# Altium project MD070B.PrjPcb (part 2 of 2)

## Sheet MD070B_INTERFACE.SchDoc
size 431 x 279 mm; Date: Not shown in title block; ApprovedBy: Not shown in title block; CheckedBy: Not shown in title block; Author: Not shown in title block; CompanyName: Not shown in title block; Engineer: Not shown in title block; Organization: Not shown in title block; Address1: Not shown in title block; Address2: Not shown in title block; Address3: Not shown in title block; Address4: Not shown in title block; DocumentNumber: 4; Revision: Use project parameter SCH_Rev; SheetNumber: 1; SheetTotal: 5; PageSetup: Record=PageOptions|CenterHorizontal=True|CenterVertical=True|PrintScale=1.00|XCorrection=1.00|YCorrection=1.00|PrintKind=0|BorderSize=5000000|LeftOffset=0|BottomOffset=0|Orientation=2|PaperLength=1000|PaperWidth=1000|Scale=100|PaperSource=15|PrintQuality=600|MediaType=1|DitherType=10|PaperKind=Letter|PrintScaleMode=1; CurrentTime: Not shown in title block; CurrentDate: Not shown in title block; Time: Not shown in title block; DocumentFullPathAndName: Not shown in title block; DocumentName: Not shown in title block; ModifiedDate: Not shown in title block; ImagePath: Not shown in title block
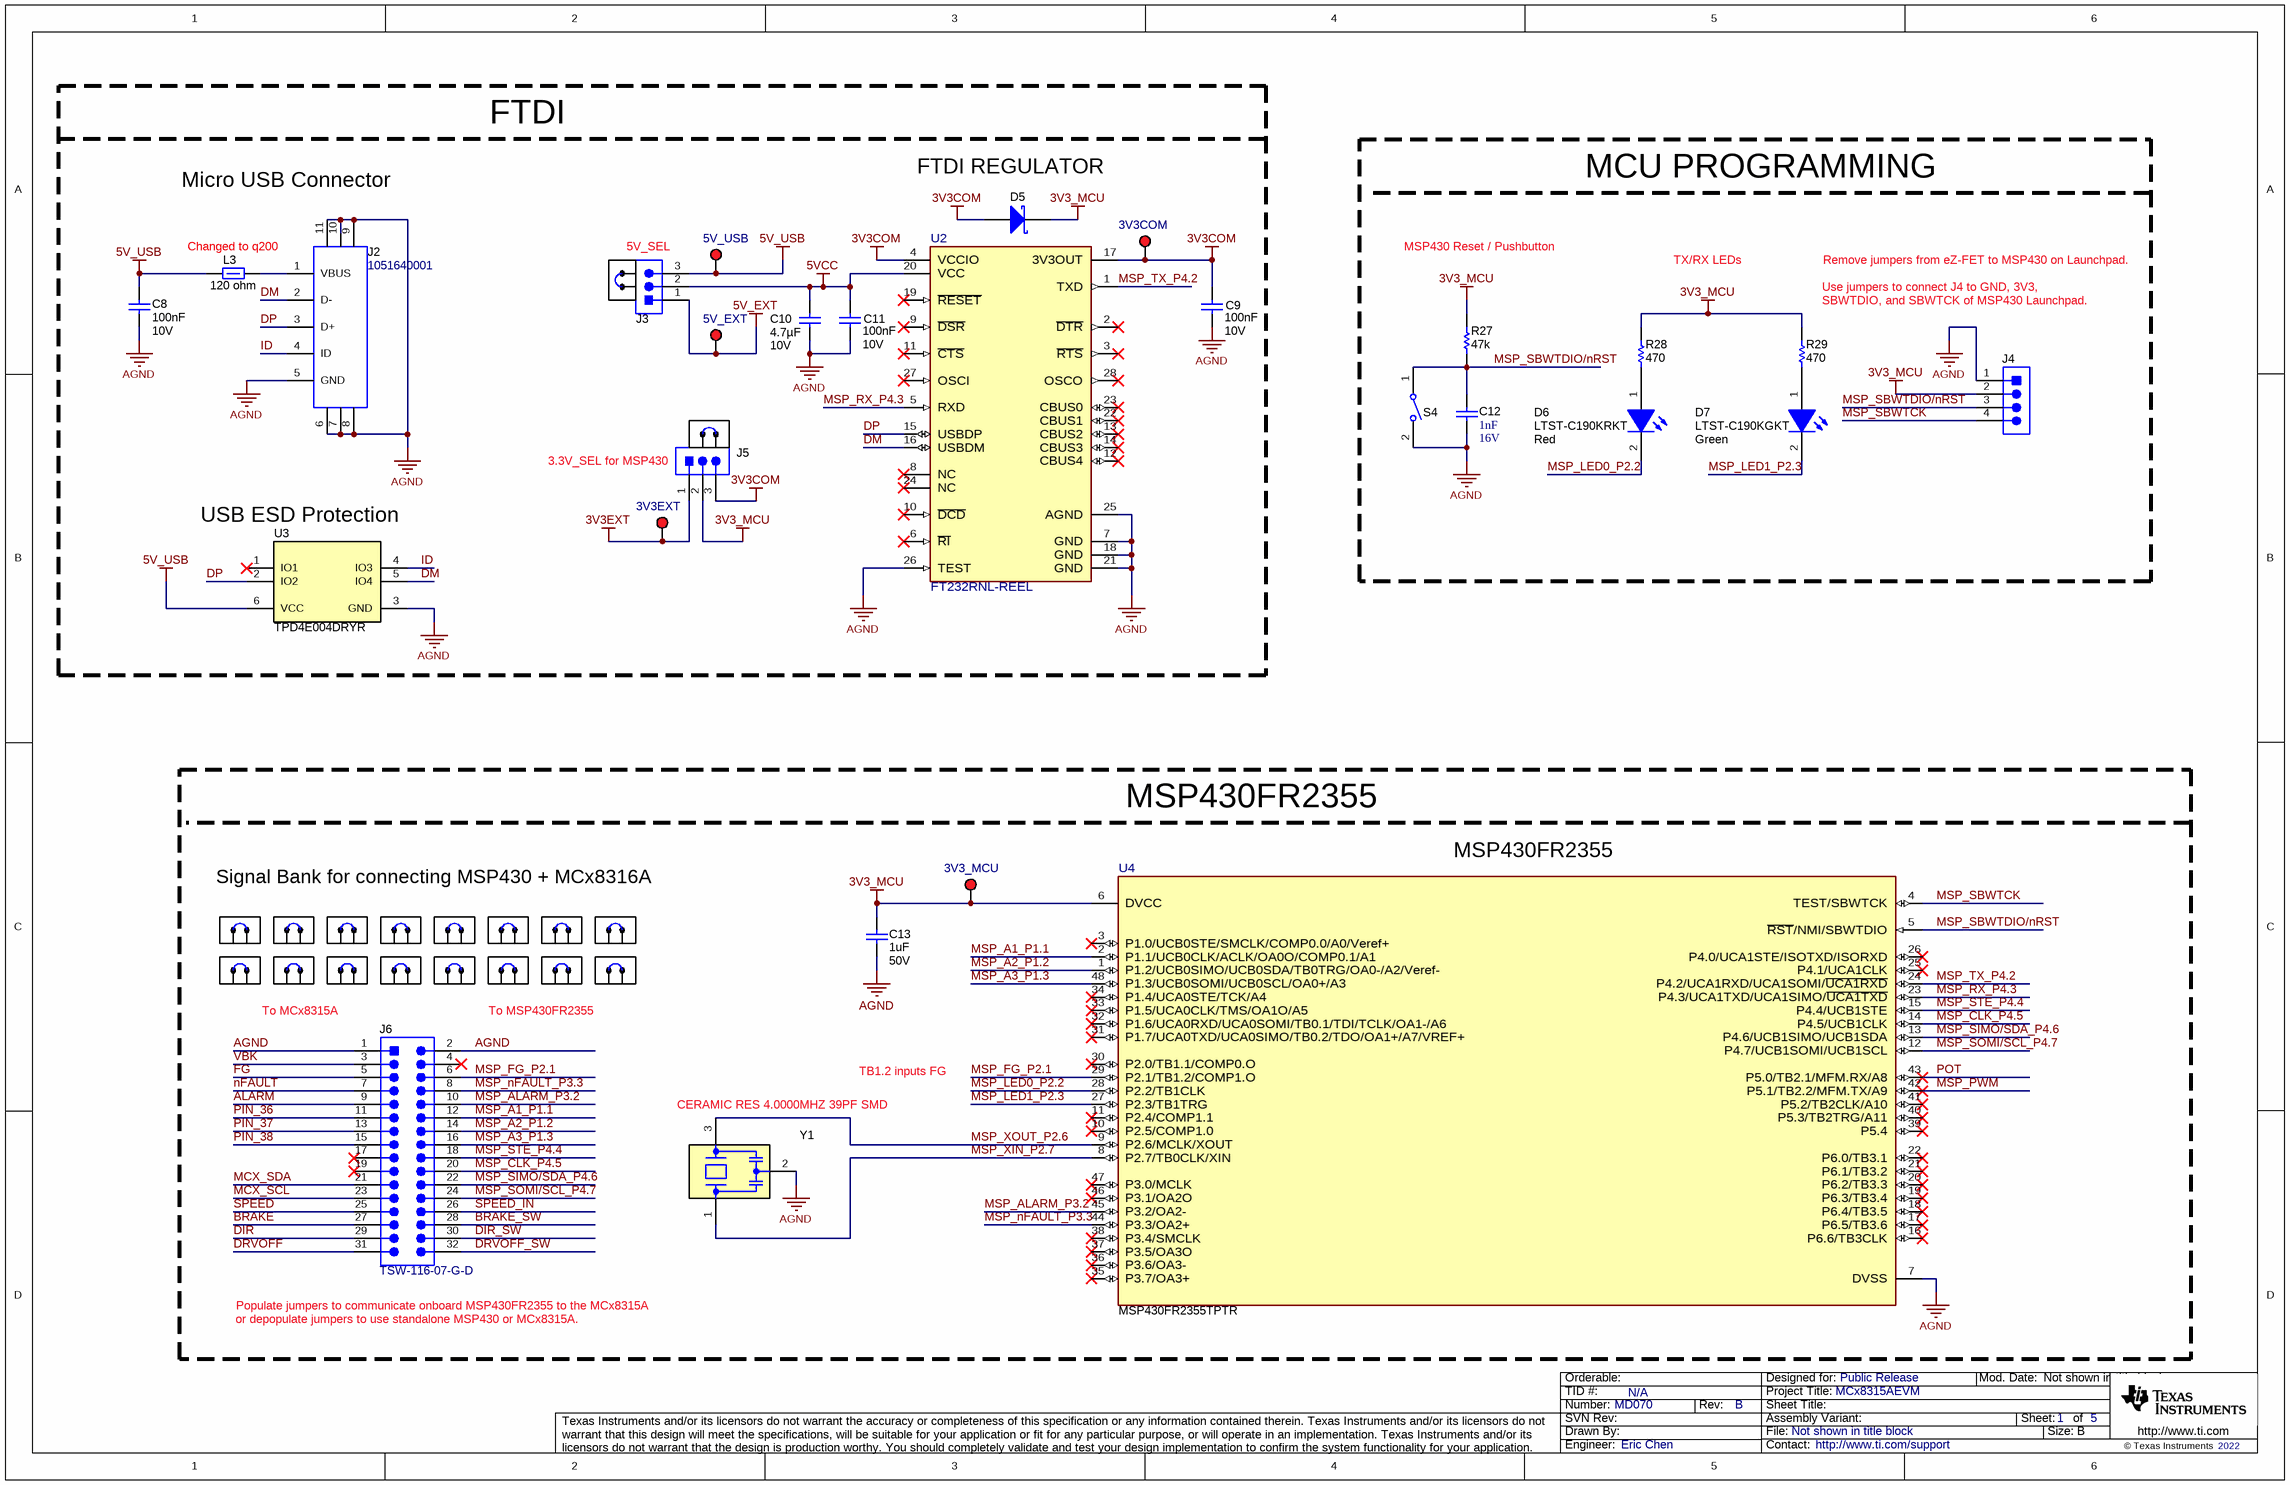
[diagram p3: MD070B_INTERFACE.SchDoc]

### Parts
C8  Cap_F: 100nF  VDC_V: 10V  [0603L]  (hidden comment: 0603ZC104KAT2A)
C9  Cap_F: 100nF  VDC_V: 10V  [0603L]  (hidden comment: 0603ZC104KAT2A)
C10  Cap_F: 4.7µF  VDC_V: 10V  [0603L]  (hidden comment: GRM188Z71A475ME15D)
C11  Cap_F: 100nF  VDC_V: 10V  [0603L]  (hidden comment: 0603ZC104KAT2A)
C12  Cap_F: 1nF  VDC_V: 16V  [0603L]  (hidden comment: 885012206034)
C13  ValueDisplayed: 1uF  VDC_V: 50V  [0805L]  (hidden comment: 885012207103)
D5  BAT165E6327HTSA1  [SOD-323]  (value not drawn)
D6  LTST-C190KRKT  value Red  [LED_LTST-C190_Red]
D7  LTST-C190KGKT  value Green  [LED_LTST-C190_G]
J2  1051640001  [Molex_1051640001]
J3  Header_3x1  [PBC03SAAN]  (value not drawn)
J4  TSW-104-07-G-S  [TSW-104-07-G-S]  (value not drawn)
J5  Header_3x1  [PBC03SAAN]  (value not drawn)
J6  TSW-116-07-G-D  [TSW-116-07-G-D]
L3  DCR_ohm: 120 ohm  [0603L]  (hidden comment: BLM18SG121TZ1D)
R27  ValueDisplayed: 47k  [0603L]  (hidden comment: RC0603JR-0747KL)
R28  ValueDisplayed: 470  [0603L]  (hidden comment: RC0603JR-07470RL)
R29  ValueDisplayed: 470  [0603L]  (hidden comment: RC0603JR-07470RL)
S4  SW_SPST-single  [SW_434121025816]  (value not drawn)
SH-J2  SNT-100-BK-G  [SNT-100-BK-G]  (value not drawn)
SH-J3  SNT-100-BK-G  [SNT-100-BK-G]  (value not drawn)
SH-J4  SNT-100-BK-G  [SNT-100-BK-G]  (value not drawn)
SH-J5  SNT-100-BK-G  [SNT-100-BK-G]  (value not drawn)
SH-J6  SNT-100-BK-G  [SNT-100-BK-G]  (value not drawn)
SH-J7  SNT-100-BK-G  [SNT-100-BK-G]  (value not drawn)
SH-J8  SNT-100-BK-G  [SNT-100-BK-G]  (value not drawn)
SH-J9  SNT-100-BK-G  [SNT-100-BK-G]  (value not drawn)
SH-J10  SNT-100-BK-G  [SNT-100-BK-G]  (value not drawn)
SH-J11  SNT-100-BK-G  [SNT-100-BK-G]  (value not drawn)
SH-J12  SNT-100-BK-G  [SNT-100-BK-G]  (value not drawn)
SH-J13  SNT-100-BK-G  [SNT-100-BK-G]  (value not drawn)
SH-J14  SNT-100-BK-G  [SNT-100-BK-G]  (value not drawn)
SH-J15  SNT-100-BK-G  [SNT-100-BK-G]  (value not drawn)
SH-J16  SNT-100-BK-G  [SNT-100-BK-G]  (value not drawn)
SH-J17  SNT-100-BK-G  [SNT-100-BK-G]  (value not drawn)
SH-J18  SNT-100-BK-G  [SNT-100-BK-G]  (value not drawn)
SH-J19  SNT-100-BK-G  [SNT-100-BK-G]  (value not drawn)
TP18  3V3COM  [Keystone5000]
TP19  5V_USB  [Keystone5000]
TP20  5V_EXT  [Keystone5000]
TP21  3V3EXT  [Keystone5000]
TP22  3V3_MCU  [Keystone5000]
U2  FT232RNL-REEL  [FP-FT232RNL-REEL_SSOP28-MFG]
U3  TPD4E004DRYR  [DRY0006A]
U4  MSP430FR2355TPTR  [PT0048A-MFG]
Y1  CSTCR4M00G55B-R0  [Murata_CSTCR_G]  (value not drawn)

### Blocks framed on the sheet
FTDI: C8-C11 D5 J2 J3 J5 L3 SH-J2 SH-J3 TP18-TP21 U2 U3
MCU PROGRAMMING: C12 D6 D7 J4 R27-R29 S4
MSP430FR2355: C13 J6 SH-J4-SH-J19 TP22 U4 Y1

### Nets
3V3_MCU: C13.1 D5.1(K) J4.2 J5.2 R27.2 R28.2 R29.2 TP22.1 U4.6(DVCC)
3V3COM: C9.1 D5.2(A) J5.3 TP18.1 U2.4(VCCIO) U2.17(3V3OUT)
3V3EXT: J5.1 TP21.1
5V_EXT: J3.1 TP20.1
5V_USB: C8.1 J3.3 L3.1 TP19.1 U3.6(VCC)
5VCC: C10.2 C11.1 J3.2 U2.20(VCC)
AGND: C8.2 C9.2 C10.1 C11.2 C12.2 C13.2 J2.5(GND) J2.6 J2.7 J2.8 J2.9 J2.10 J2.11 J4.1 J6.1 J6.2 S4.2 U2.7(GND) U2.18(GND) U2.21(GND) U2.25(AGND) U2.26(TEST) U3.3(GND) U4.7(DVSS) Y1.2(GND)
VBK: J6.3
ALARM: J6.9
BRAKE: J6.27
BRAKE_SW: J6.28
DIR: J6.29
DIR_SW: J6.30
DM: J2.2(D-) U2.16(USBDM) U3.5(IO4)
DP: J2.3(D+) U2.15(USBDP) U3.2(IO2)
DRVOFF: J6.31
DRVOFF_SW: J6.32
FG: J6.5
ID: J2.4(ID) U3.4(IO3)
MCX_SCL: J6.23
MCX_SDA: J6.21
MSP_A1_P1.1: J6.12 U4.2(P1.1/UCB0CLK/ACLK/OA0O/COMP0.1/A1)
MSP_A2_P1.2: J6.14 U4.1(P1.2/UCB0SIMO/UCB0SDA/TB0TRG/OA0-/A2/Veref-)
MSP_A3_P1.3: J6.16 U4.48(P1.3/UCB0SOMI/UCB0SCL/OA0+/A3)
MSP_ALARM_P3.2: J6.10 U4.45(P3.2/OA2-)
MSP_CLK_P4.5: J6.20 U4.14(P4.5/UCB1CLK)
MSP_FG_P2.1: J6.6 U4.29(P2.1/TB1.2/COMP1.O)
MSP_LED0_P2.2: D6.2(K) U4.28(P2.2/TB1CLK)
MSP_LED1_P2.3: D7.2(K) U4.27(P2.3/TB1TRG)
MSP_nFAULT_P3.3: J6.8 U4.44(P3.3/OA2+)
MSP_PWM: U4.42(P5.1/TB2.2/MFM.TX/A9)
MSP_RX_P4.3: U2.5(RXD) U4.23(P4.3/UCA1TXD/UCA1SIMO/~{UCA1TXD})
MSP_SBWTCK: J4.4 U4.4(TEST/SBWTCK)
MSP_SBWTDIO/nRST: C12.1 J4.3 R27.1 S4.1 U4.5(~{RST}/NMI/SBWTDIO)
MSP_SIMO/SDA_P4.6: J6.22 U4.13(P4.6/UCB1SIMO/UCB1SDA)
MSP_SOMI/SCL_P4.7: J6.24 U4.12(P4.7/UCB1SOMI/UCB1SCL)
MSP_STE_P4.4: J6.18 U4.15(P4.4/UCB1STE)
MSP_TX_P4.2: U2.1(TXD) U4.24(P4.2/UCA1RXD/UCA1SOMI/~{UCA1RXD})
MSP_XIN_P2.7: U4.8(P2.7/TB0CLK/XIN) Y1.1(In)
MSP_XOUT_P2.6: U4.9(P2.6/MCLK/XOUT) Y1.3(Out)
nFAULT: J6.7
PIN_36: J6.11
PIN_37: J6.13
PIN_38: J6.15
POT: U4.43(P5.0/TB2.1/MFM.RX/A8)
SPEED: J6.25
SPEED_IN: J6.26
NetD6_1: D6.1(A) R28.1
NetD7_1: D7.1(A) R29.1
NetJ2_1: J2.1(VBUS) L3.2

Not connected (* = marked no-connect by the designer): J6 4* 17* 19*; U2 2(~{DTR})* 3(~{RTS})* 6(~{RI})* 8(NC)* 9(~{DSR})* 10(~{DCD})* 11(~{CTS})* 12(CBUS4)* 13(CBUS2)* 14(CBUS3)* 19(~{RESET})* 22(CBUS1)* 23(CBUS0)* 24(NC)* 27(OSCI)* 28(OSCO)*; U3 1(IO1)*; U4 3(P1.0/UCB0STE/SMCLK/COMP0.0/A0/Veref+)* 10(P2.5/COMP1.0)* 11(P2.4/COMP1.1)* 16(P6.6/TB3CLK)* 17(P6.5/TB3.6)* 18(P6.4/TB3.5)* 19(P6.3/TB3.4)* 20(P6.2/TB3.3)* 21(P6.1/TB3.2)* 22(P6.0/TB3.1)* 25(P4.1/UCA1CLK)* 26(P4.0/UCA1STE/ISOTXD/ISORXD)* 30(P2.0/TB1.1/COMP0.O)* 31(P1.7/UCA0TXD/UCA0SIMO/TB0.2/TDO/OA1+/A7/VREF+)* 32(P1.6/UCA0RXD/UCA0SOMI/TB0.1/TDI/TCLK/OA1-/A6)* 33(P1.5/UCA0CLK/TMS/OA1O/A5)* 34(P1.4/UCA0STE/TCK/A4)* 35(P3.7/OA3+)* 36(P3.6/OA3-)* 37(P3.5/OA3O)* 38(P3.4/SMCLK)* 39(P5.4)* 40(P5.3/TB2TRG/A11)* 41(P5.2/TB2CLK/A10)* 46(P3.1/OA2O)* 47(P3.0/MCLK)*

### Notes on the sheet
- (near D5) FTDI REGULATOR
- Micro USB Connector
- (near L3) Changed to q200
- 5V_SEL
- MSP430 Reset / Pushbutton
- TX/RX LEDs
- (near R29) Use jumpers to connect J4 to GND, 3V3,
- SBWTDIO, and SBWTCK of MSP430 Launchpad.
- Remove jumpers from eZ-FET to MSP430 on Launchpad.
- (near J5) 3.3V_SEL for MSP430
- (near U3) USB ESD Protection
- Signal Bank for connecting MSP430 + MCx8316A
- (near U4) MSP430FR2355
- To MCx8315A
- To MSP430FR2355
- (near Y1) CERAMIC RES 4.0000MHZ 39PF SMD
- TB1.2 inputs FG
- (near J6) Populate jumpers to communicate onboard MSP430FR2355 to the MCx8315A
- or depopulate jumpers to use standalone MSP430 or MCx8315A.
- Drawn By:
- SVN Rev:
- Number:
- TID #:
- Orderable:
- Rev:
- Sheet Title:
- File:
- Project Title:
- Designed for:
- Assembly Variant:
- Mod. Date:
- Sheet:
- Size:
- of
- B
- http://www.ti.com
- Texas Instruments and/or its licensors do not warrant the accuracy or completeness of this specification or any information contained therein. Texas Instruments and/or its licensors do not warrant that this design will meet the specifications, will be suitable for your application or fit for any particular purpose, or will operate in an implementation. Texas Instruments and/or its licensors do not warrant that the design is production worthy. You should completely validate and test your design implementation to confirm the system functionality for your application.
- Engineer:
- Contact:
- © Texas Instruments

### Library data of the parts
C8 C9 C11 = CMP-0006815-4: CAP, CERM, 0.1 uF, 10 V, +/- 10%, X7R, 0603; Manufacturer: AVX; TaMin_C: -55°C; Polarized: N; SizeAreaWB_mm2: 4.68; Value1: Unknown; U/M: EA; Value: 0.1uF; TaMax_C: 125°C; SizeZ_mm: 1; SizeX_mm: 1.6; SizeY_mm: 0.8; Cap_Case: 0603; SizeArea_mm2: 1.28; AEC Category: Q200; ComponentLink1URL: http://datasheets.avx.com/X7RDielectric.pdf; Supplier Part Number 2: 94W2856; Publisher: Texas Instruments; Supplier 2: Newark; Supplier Part Number 3: 581-0603ZC104K; TempCo: X7R; Supplier 3: Mouser; Published: 2008-06-19; RoHS: Y; MountType: SMT; Supplier 1: Digi-Key; PackageReference: 0603; Tolerance_%: 10%; Value2: 10V; CompType: Capacitor; LatestRevisionDate: 2017-03-09; PartNumber: 0603ZC104KAT2A; AEC Qualified: N; ComponentLink1Description: Datasheet link; AEC Grade: N/A; Supplier Part Number 1: 478-7939-1-ND; Technology: Ceramic; ValueDisplayed: 0.1uF
C10 = CMP-0007498-4: CAP, CERM, 4.7 uF, 10 V, +/- 20%, X7R, 0603; Manufacturer: MuRata; TaMin_C: -55°C; Polarized: N; SizeAreaWB_mm2: 4.68; Value1: Unknown; U/M: EA; Value: 4.7uF; TaMax_C: 125°C; SizeZ_mm: 1; SizeX_mm: 1.6; SizeY_mm: 0.8; Cap_Case: 0603; SizeArea_mm2: 1.28; AEC Category: Q200; Publisher: Texas Instruments; Supplier 2: Newark; Supplier Part Number 3: 81-GRM188Z71A475ME5D; TempCo: X7R; Supplier 3: Mouser; Published: 2008-06-19; RoHS: Y; MountType: SMT; Supplier 1: Digi-Key; PackageReference: 0603; Tolerance_%: 20%; Value2: 10V; CompType: Capacitor; LatestRevisionDate: 2017-03-09; PartNumber: GRM188Z71A475ME15D; AEC Qualified: N; ComponentLink1Description: Datasheet link; AEC Grade: N/A; Technology: Ceramic; ValueDisplayed: 4.7uF; ComponentLink1URL: http://search.murata.co.jp/Ceramy/image/img/A01X/G101/ENG/GRM188Z71A475ME15-01.pdf
C12 = CMP-0006826-4: CAP, CERM, 1000 pF, 16 V, +/- 10%, X7R, 0603; Manufacturer: Wurth Elektronik; TaMin_C: -55°C; Polarized: N; SizeAreaWB_mm2: 4.68; Value1: Unknown; U/M: EA; Value: 1000pF; TaMax_C: 125°C; SizeZ_mm: 1; SizeX_mm: 1.6; SizeY_mm: 0.8; Cap_Case: 0603; SizeArea_mm2: 1.28; AEC Category: Q200; Publisher: Texas Instruments; TempCo: X7R; Published: 2008-06-19; RoHS: Y; MountType: SMT; Supplier 1: Mouser; PackageReference: 0603; Tolerance_%: 10%; Value2: 16V; CompType: Capacitor; LatestRevisionDate: 2017-03-09; PartNumber: 885012206034; AEC Qualified: N; ComponentLink1Description: Datasheet link; AEC Grade: N/A; Supplier Part Number 1: 710-885012206034; Technology: Ceramic; ValueDisplayed: 1000pF; ComponentLink1URL: http://katalog.we-online.de/pbs/datasheet/885012206034.pdf
C13 = CMP-0007696-2: CAP, CERM, 1 uF, 50 V, +/- 10%, X7R, 0805; Manufacturer: Wurth Elektronik; Polarized: N; CompType: Capacitor; Value: 1uF; U/M: EA; Cap_F: 1µF; Value1: Unknown; TaMin_C: -55°C; TaMax_C: 125°C; Cap_Case: 0805; SizeArea_mm2: 2.5; SizeAreaWB_mm2: 6.75; SizeX_mm: 2; SizeY_mm: 1.25; SizeZ_mm: 1.45; AEC Category: Q200; PartNumber: 885012207103; PackageReference: 0805; RoHS: Y; Tolerance_%: 10%; Value2: 50V; MountType: SMT; Technology: Ceramic; TempCo: X7R; Published: 2008-06-19; Publisher: Texas Instruments; LatestRevisionDate: 2017-03-09; ComponentLink1Description: Datasheet link; ComponentLink1URL: http://katalog.we-online.de/pbs/datasheet/885012207103.pdf; Supplier 1: Mouser; Supplier Part Number 1: 710-885012207103; AEC Qualified: N; AEC Grade: N/A
D5 = CMP-0028882-2: Diode, Schottky, 40 V, 0.75 A, AEC-Q101, SOD-323; Manufacturer: Infineon Technologies; Vf_V: 740mV; Value: 40V; Value1: 0.75A; Value2: 0.74V; Io_A: 750mA; TJmax_C: 150°C; AEC Category: Q101; AEC Qualified: Y; Green_Lifecycle: Not Set; Green_REACh: Incomplete; SizeArea_mm2: 3.645; SizeAreaWB_mm2: 8.695; SizeX_mm: 2.7; SizeY_mm: 1.35; SizeZ_mm: 1; CompType: Diode; PartNumber: BAT165E6327HTSA1; PackageReference: SOD-323; Vr_V: 40V; MountType: SMT; Type: Schottky; RoHS: Y; ComponentLink1Description: Datasheet link; ComponentLink1URL: http://www.infineon.com/dgdl/bat165series.pdf?folderId=db3a304313d846880113def5812204a1&fileId=db3a304313d846880113df01f69804d6; Green_EU RoHS-2: Incomplete; Green_EU RoHS: Incomplete
D6 = CMP-0078131-2: LED, Red, SMD; Manufacturer: Lite-On; Type: AlInGaP; Ir_A: 10µA; Angle: 130; Power_TotalModule: 62.5mW; Value2: 2V; Green_Lifecycle: Not Set; Io_A: 20mA; Value1: .0625W; Green_REACh: Incomplete; Vr_V: 5V; Green_EU RoHS: Incomplete; Green_EU RoHS-2: Incomplete; CompType: LED; Color: Red; ComponentLink1URL: http://optoelectronics.liteon.com/upload/download/DS-22-99-0151/LTST-C190KRKT.pdf; RoHS: Y; Vf_V: 2V; PackageReference: Red LED, 1.6x0.8x0.8mm; ComponentLink1Description: Datasheet link; PartNumber: LTST-C190KRKT; MountType: SMT
D7 = CMP-0002840-2: LED, Green, SMD; Manufacturer: Lite-On; Type: AlInGaP; Value2: 2V; Io_A: 30mA; Value1: W; Tjmax_C: 85°C; CompType: LED; Color: green; ComponentLink1URL: http://optoelectronics.liteon.com/en-us/api/DwonloadFileHandler.ashx?txtSpecNo=DS22-2000-074&txtPartNo=LTST-C190KGKT; RoHS: Y; Vf_V: 2V; PackageReference: 1.6x0.8x0.8mm; ComponentLink1Description: Datasheet link; PartNumber: LTST-C190KGKT; MountType: SMT
J2 = CMP-0055311-1: Receptacle, USB 2.0, Micro B, 5 Position, R/A, SMT; Manufacturer: Molex; CNHeader: FALSE; Current_A: 1.8A; Gender: Female; Voltage_V: 30V; Pitch_mm: 0.65; ContactFinish: Gold; CT: TRUE; Cert_UL: Y; ComponentLink1URL: http://www.molex.com/pdm_docs/sd/1051640001_sd.pdf; Supplier Part Number 2: 99Y3224; Publisher: Texas Instruments; Supplier 2: Newark; Supplier Part Number 3: 538-105164-0001; Color: Black; Supplier 3: Mouser; RoHS: Y; MountType: SMT; Supplier 1: Digi-Key; PackageReference: Receptacle, USB 2.0, Micro B, 5 Pos, 0.65mm Pitch, R/A, SMT; PinCount: 5; CompType: USB; LatestRevisionDate: 26/05/2017; PartNumber: 1051640001; Orientation: R/A; ComponentLink1Description: Datasheet URL; Supplier Part Number 1: WM11263CT-ND
J3 J5 = CMP-0002334-1: Header, 100mil, 3x1, Gold, TH; Manufacturer: Sullins Connector Solutions; CNHeader: TRUE; CT: FALSE; Green_Lifecycle: Not Set; Green_REACh: Incomplete; PartNumber: PBC03SAAN; PackageReference: PBC03SAAN; ClassName: Header; CompType: Header; RoHS: Y; MountType: TH; ComponentLink1Description: Datasheet URL; ComponentLink1URL: http://www.sullinscorp.com/catalogs/77_Page78-79_HEADER_.100_2.54mm_MALE_BREAKAWAY.pdf; Publisher: Texas Instruments; LatestRevisionDate: 26/05/2017; Supplier 1: Digi-Key; Supplier Part Number 1: S1011E-03-ND; Green_EU RoHS-2: Incomplete; Green_EU RoHS: Incomplete
J4 = CMP-0075409-2: Header, 100mil, 4x1, Gold, TH; Manufacturer: Samtec; Pitch_mm: 2.54; Cert_VDE: N; Gender: Male; Cert_CSA: Y; Voltage_V: 550V; Green_REACh: Passed; Current_A: 6.3A; Green_Lifecycle: Active; Row_Count: 1; ComponentLink1Description: Datasheet URL; RoHS: Y; Supplier 1: Digi-Key; Cert_UL: Y; Orientation: Vertical; Green_EU RoHS: Passed; PackageReference: 4x1 Header; Color: Black; PartNumber: TSW-104-07-G-S; PinCount: 4; ContactFinish: Gold; Cert_CULUS: N; Shrouded: N; ClassName: Header; ComponentLink1URL: http://samtec.com/ftppub/pdf/TSW_TH.PDF; CompType: Header; MountType: TH; Supplier Part Number 1: SAM1029-04-ND; Green_EU RoHS-2: Passed
J6 = CMP-0075429-1: Header, 100mil, 16x2, Gold, TH; Manufacturer: Samtec; Pitch_mm: 2.54; Cert_VDE: N; Gender: Male; Cert_CSA: Y; Voltage_V: 550V; Green_REACh: Passed; Current_A: 6.3A; CT: False; Green_Lifecycle: Active; Row_Count: 2; CNHeader: True; ComponentLink1Description: Datasheet URL; RoHS: Y; Supplier 1: Digi-Key; Cert_UL: Y; Orientation: Vertical; Green_EU RoHS: Passed; PackageReference: 16x2 Header; Color: Black; PartNumber: TSW-116-07-G-D; PinCount: 32; Publisher: Texas Instruments; ContactFinish: Gold; Cert_CULUS: N; Shrouded: N; ClassName: Header; RowSpacing_mm: 2.54; ComponentLink1URL: http://samtec.com/ftppub/pdf/TSW_TH.PDF; LatestRevisionDate: 2017-07-12; CompType: Header; MountType: TH; Supplier Part Number 1: SAM1028-16-ND; Green_EU RoHS-2: Passed
L3 = CMP-0084877-1: Inductor, Ferrite Bead, Ferrite, 3 A, 120 ohm, AEC-Q200 Grade 1, SMD; Manufacturer: MuRata; SizeX_mm: 1.6; AEC Grade: 1; Value2: 3A; SizeY_mm: 0.8; SizeAreaWB_mm2: 4.68; SizeArea_mm2: 1.28; AEC Qualified: Y; AEC Category: Q200; CompType: Inductor; Technology: Ferrite Bead; Value1: 120 ohm; RoHS: Y; ComponentLink1URL: https://www.murata.com/en-us/products/productdata/8796750610462/QNFA9122.pdf; SizeZ_mm: 1; Material: Ferrite; PackageReference: 0603; PartNumber: BLM18SG121TZ1D; MountType: SMT; Imax_A: 3A; ComponentLink1Description: Datasheet link
R27 = CMP-0025925-5: RES, 47 k, 5%, 0.1 W, 0603; Manufacturer: Yageo; Power_W: 100mW; TempCo: 100 ppm/C; Value_Code: 47k0; Value: 47k; EIA_Code: E24; SizeX_mm: 1.6; SizeY_mm: 0.8; SizeZ_mm: 1; Value2: 0.1W; SizeArea_mm2: 1.28; AEC Qualified: N; VDC_V: 75V; AEC Category: Q200; SizeAreaWB_mm2: 4.68; Supplier Part Number 2: 603-RC0603JR-0747KL; Supplier 2: Mouser; Supplier Part Number 3: 9233580; Supplier 3: Farnell; RoHS: Y; Value1: 5%; MountType: SMT; Supplier 1: Digi-Key; PackageReference: 0603; Tolerance_%: 5%; Res_ohm: 47k; CompType: Resistor; PartNumber: RC0603JR-0747KL; ComponentLink1Description: Datasheet link; Supplier Part Number 1: 311-47KGRCT-ND; Technology: Thick Film; ComponentLink1URL: http://www.yageo.com/pdf/Pu-RC0603_51_PbFree_L_2.pdf; AEC Grade: N/A
R28 R29 = CMP-0025924-5: RES, 470, 5%, 0.1 W, 0603; Manufacturer: Yageo; Power_W: 100mW; TempCo: 100 ppm/C; Value_Code: 470R; Value: 470; EIA_Code: E24; SizeX_mm: 1.6; SizeY_mm: 0.8; SizeZ_mm: 1; Value2: 0.1W; SizeArea_mm2: 1.28; AEC Qualified: N; VDC_V: 75V; AEC Category: Q200; SizeAreaWB_mm2: 4.68; Supplier Part Number 2: 603-RC0603JR-07470RL; Supplier 2: Mouser; Supplier Part Number 3: 9233334; Supplier 3: Farnell; RoHS: Y; Value1: 5%; MountType: SMT; Supplier 1: Digi-Key; PackageReference: 0603; Tolerance_%: 5%; Res_ohm: 470; CompType: Resistor; PartNumber: RC0603JR-07470RL; ComponentLink1Description: Datasheet link; Supplier Part Number 1: 311-470GRCT-ND; Technology: Thick Film; ComponentLink1URL: http://www.yageo.com/pdf/Pu-RC0603_51_PbFree_L_2.pdf; AEC Grade: N/A
S4 = CMP-0002196-2: Switch, Tactile, SPST, 12 V, SMD; PartNumber: 434121025816; Manufacturer: Wurth Elektronik; VDC_V: 12V; SwitchFunction: Off-On; PositionCount: 1; CurrentRating_mA: 50A; MountType: SMT; ComponentLink1Description: Datasheet URL; ComponentLink1URL: http://katalog.we-online.de/em/datasheet/434121025816.pdf; RoHS: Y; Circuit: SPST; Orientation: Top Actuated; CompType: Switch; PackageReference: SMD, 6x3.9mm; Publisher: Texas Instruments; LatestRevisionDate: 2017-03-09; Supplier 1: Newark; Supplier Part Number 1: 31T8978; Supplier 2: Farnell; Supplier Part Number 2: 1867991
SH-J2-SH-J19 = CMP-0003623-3: as SH-J1 on sheet MD070B_CONTROL; ComponentLink1URL: http://www.samtec.com/ftppub/pdf/SNT.PDF; Supplier 1: Digi-Key; CompType: Shunt; PackageReference: Shunt; ClassName: Shunt; RoHS: Y; Supplier Part Number 1: SAM8858-ND; MountType: N/A; PartNumber: SNT-100-BK-G; ComponentLink1Description: Datasheet Link
TP18-TP22 = CMP-0055137-1: Test Point, Miniature, Red, TH; PartNumber: 5000; Manufacturer: Keystone; ContactFinish: Silver; CNHeader: FALSE; CT: TRUE; Green_Lifecycle: Active; Green_REACh: Passed; PackageReference: Red Miniature Testpoint; CompType: Test Point; RoHS: Y; MountType: TH; ComponentLink1Description: Datasheet URL; ComponentLink1URL: http://www.keyelco.com/userAssets/file/M60-2p60.pdf; Publisher: Texas Instruments; LatestRevisionDate: 26/05/2017; Supplier 1: Digi-Key; Supplier Part Number 1: 36-5000-ND; Supplier 2: Mouser; Supplier Part Number 2: 534-5000; Color: Red; Green_EU RoHS-2: Incomplete; Green_EU RoHS: Passed
U2 = CMP-0121693-1: UART Interface IC USB Full Speed to Serial UART IC, Includes Oscillator and EEPROM, SSOP-28; Manufacturer: FTDI; SizeZ_mm: 2mm; AEC Qualified: No; Data Rate: 3Mbits/s; Interface: UART,USB; Max Supply Voltage: 5.25V; Min Supply Voltage: 1.8V; Nominal Supply Current: 7mA; Number Of Ports: 1; Standoff Height: 0.05mm; TaMax_C: +85°C; TaMin_C: -40°C; Usb Standard: USB 2.0; PackageReference: SSOP28; PartNumber: FT232RNL-REEL; RoHS: TRUE; Supplier 1: Digikey; Supplier 2: Mouser; Supplier Part Number 1: 768-FT232RNL-REELCT-ND; Supplier Part Number 2: 895-FT232RNL-REEL; Part Number: FT232RNL-REEL; datasheet: https://ftdichip.com/wp-content/uploads/2023/03/DS_FT232RN.pdf; Datasheet Path: datasheets/IC-FT232RNL-REEL.pdf; Digikey Description: USB FULL SPEED TO SERIAL UART IC; Digikey Part Number: 768-FT232RNL-REELCT-ND; helpURL: https://upverter.com/upn/revision/7db2f58cc6935634/; Lead Free: Yes; Mouser Description: Integrated Circuit Interface USB-UART; RS-232; 12Mbs; 3, 3v-5.25V; -40+85 deg.C; SMD; SSOP28; Mouser Part Number: 895-FT232RNL-REEL; Operating Temperature Range: -40°C to +85°C; ComponentLink1Description: Datasheet; ComponentLink1URL: https://ftdichip.com/wp-content/uploads/2023/03/DS_FT232RN.pdf
U3 = CMP-0043115-3: 4-Channel ESD Protection Array for High-Speed Data Interfaces, DRY0006A (USON-6); Manufacturer: Texas Instruments; IO Leakage Current(nA): 1; USB High Speed: TRUE; IO Capacitance(Typ)(pF): 1.6; Eco-Plan: Green (RoHS & no Sb/Br); IEC 61000-4-2 Contact(+/- kV): 8; Breakdown Voltage(Min)(V): 6; IEC 61000-4-2 Air-Gap(+/- kV): 12; AEC Category: Q200; AEC Qualified: N; CompType: IC; SizeAreaWB_mm2: 4.9; SizeArea_mm2: 1.45; SizeX_mm: 1.0; SizeZ_mm: 0.6; Rating: Catalog; ComponentLink3URL: http://www.ti.com/product/tpd4e004/datasheet; ComponentLink1Description: Datasheet Link; ComponentLink2URL: http://www.ti.com/product/tpd4e004; ComponentLink1URL: http://www.ti.com/lit/ds/symlink/tpd4e004.pdf; PackageDescription: USON-6; 1394 / Firewire: TRUE; PackageReference: DRY0006A; ComponentLink3Description: Online Datasheet; ComponentLink2Description: Product Folder; Serial ATA / eSATA: TRUE; PartNumber: TPD4E004DRYR; MountType: SMT; RoHS: Y; SizeY_mm: 1.45; Operating Temperature Range: -40 to 85 C
U4 = CMP-0089204-1: CPU16 MSP430™ FRAM Microcontroller IC 16-Bit 24MHz 32KB (32K x 8) FRAM 48-LQFP (7x7); Manufacturer: Texas Instruments; Memory Type: OTHER; Data Bus Width: 16bits; Number Of Spi Channels: 4; Number Of I/Os: 44; Number Of Uart Channels: 2; AEC Qualified: No; Standoff Height: 0.05mm; Ram Size: 4KBytes; TaMin_C: -40°C; Core Architecture: RISC; Number Of Adc Channels: 12; SizeZ_mm: 1.6mm; Number Of A/D Converters: 1; Memory Size: 32KBytes; TaMax_C: +105°C; TJmax_C: +115°C; Interface: I2C,SPI,UART,USART,SCI,IrDA; Min Supply Voltage: 1.8V; Max Supply Voltage: 3.6V; datasheet: http://www.ti.com/lit/ds/symlink/msp430fr2355.pdf; Part Number: MSP430FR2355TPTR; Device Class L1: Integrated Circuits (ICs); Digikey Part Number: 296-50261-1-ND; Datasheet Path: datasheets/IC-MSP430FR2355TPTR.pdf; Frequency_Fixed: 24MHz; PartNumber: MSP430FR2355TPTR; Operating Temperature Range: -40°C to +105°C; Device Class L2: Embedded Processors and Controllers; RoHS: TRUE; Mouser Part Number: 595-MSP430FR2355TPTR; Number Of Timers/Counters: 4; Number Of I2C Channels: 2; Number Of Cores: 1; helpURL: https://upverter.com/upn/revision/f866b8320dbaa695/; Device Class L3: Microcontrollers; Lead Free: Yes; Digikey Description: IC MCU 16BIT 32KB FRAM 48LQFP; ComponentLink1Description: Datasheet; PackageReference: LQFP48; ComponentLink1URL: http://www.ti.com/lit/ds/symlink/msp430fr2355.pdf
Y1 = CMP-0084387-1: Resonator, 4 MHz, 39 pF, AEC-Q200 Grade 1, SMD; Manufacturer: MuRata; Load Capacitance: 39 pF; AEC Qualified: Y; TaMax_C: 125°C; AEC Category: Q200; SizeArea_mm2: 9; SizeZ_mm: 1.2; Frequency_Fixed: 4MHz; SizeAreaWB_mm2: 16.5; SizeY_mm: 2; SizeX_mm: 4.5; TaMin_C: -40°C; AEC Grade: 1; PackageReference: 4.5x1.2x2 mm; ComponentLink1Description: Datasheet Link; MountType: SMT; CompType: Resonator; PartNumber: CSTCR4M00G55B-R0; ComponentLink1URL: https://www.murata.com/~/media/webrenewal/support/library/catalog/products/timingdevice/ceralock/p16e.ashx; RoHS: Y

## Sheet MD070B_POWER_AND_CONNECTORS.SchDoc
size 431 x 279 mm; Date: Not shown in title block; ApprovedBy: Not shown in title block; CheckedBy: Not shown in title block; Author: Not shown in title block; CompanyName: Not shown in title block; Engineer: Not shown in title block; Organization: Not shown in title block; Address1: Not shown in title block; Address2: Not shown in title block; Address3: Not shown in title block; Address4: Not shown in title block; DocumentNumber: 5; Revision: Use project parameter SCH_Rev; SheetNumber: 4; SheetTotal: 5; PageSetup: Record=PageOptions|CenterHorizontal=True|CenterVertical=True|PrintScale=1.00|XCorrection=1.00|YCorrection=1.00|PrintKind=0|BorderSize=5000000|LeftOffset=0|BottomOffset=0|Orientation=2|PaperLength=1000|PaperWidth=1000|Scale=100|PaperSource=15|PrintQuality=600|MediaType=1|DitherType=10|PaperKind=Letter|PrintScaleMode=1; CurrentTime: Not shown in title block; CurrentDate: Not shown in title block; Time: Not shown in title block; DocumentFullPathAndName: Not shown in title block; DocumentName: Not shown in title block; ModifiedDate: Not shown in title block; ImagePath: Not shown in title block
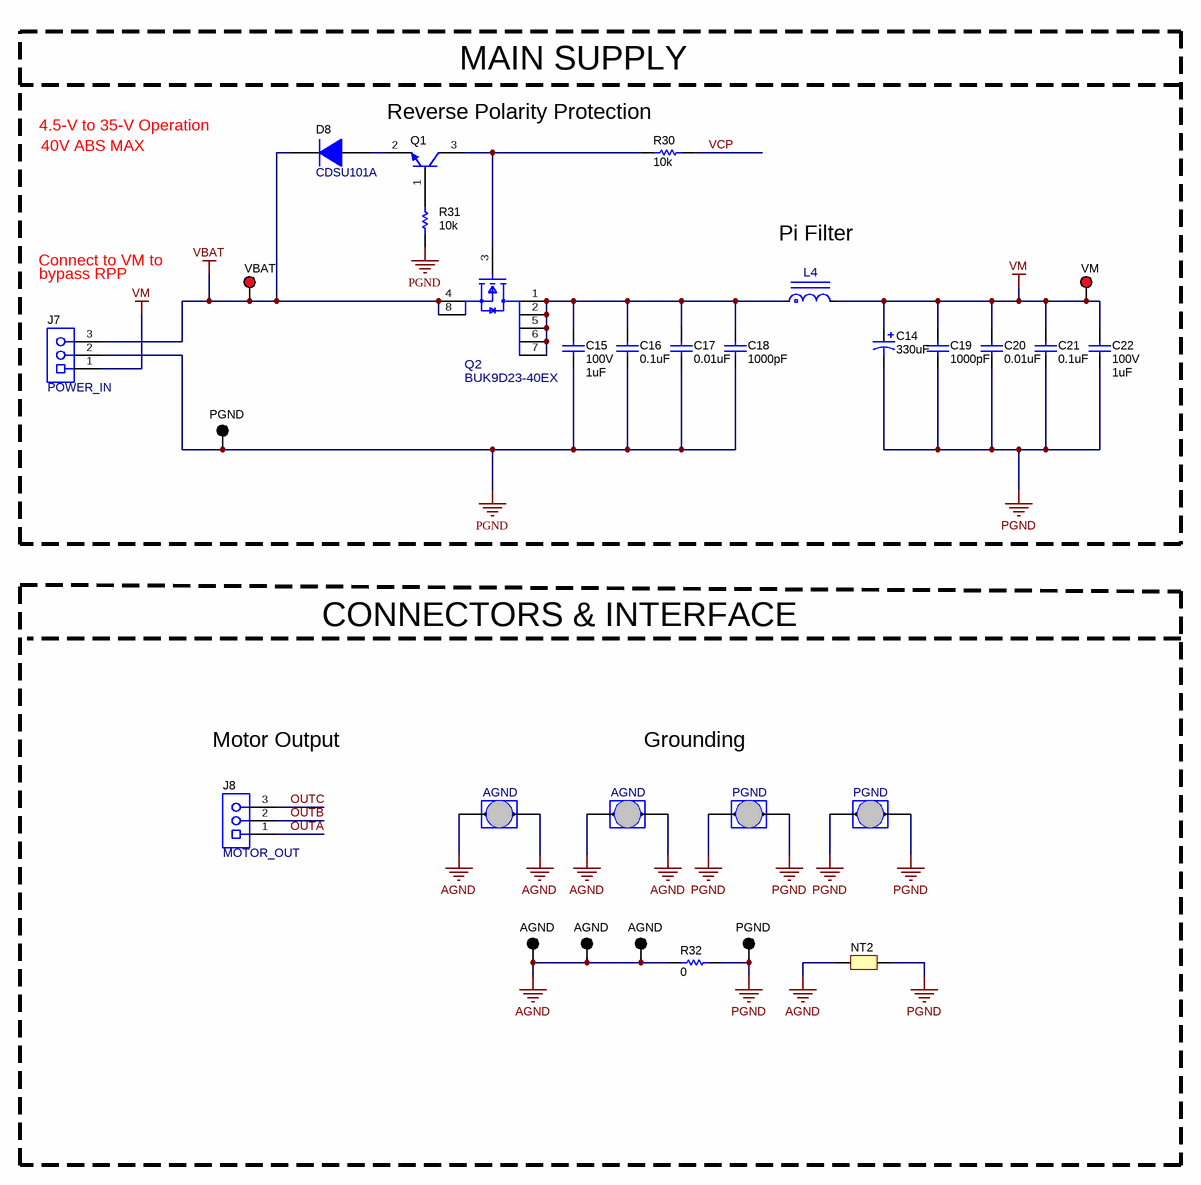
[diagram p4: MD070B_POWER_AND_CONNECTORS.SchDoc]

### Parts
C14  ValueDisplayed: 330uF  [Chemi-Con_1250x2000]  (hidden comment: ELXZ630ELL331MK20S)
C15  VDC_V: 100V  ValueDisplayed: 1uF  [1206_180]  (hidden comment: CL31B105KCHNNNE)
C16  ValueDisplayed: 0.1uF  [0603L]  (hidden comment: CGA3E3X7S2A104K080AB)
C17  ValueDisplayed: 0.01uF  [0603L]  (hidden comment: CGA3E2X7R2A103K080AA)
C18  ValueDisplayed: 1000pF  [0603L]  (hidden comment: CGA3E2X7R2A102K080AA)
C19  ValueDisplayed: 1000pF  [0603L]  (hidden comment: CGA3E2X7R2A102K080AA)
C20  ValueDisplayed: 0.01uF  [0603L]  (hidden comment: CGA3E2X7R2A103K080AA)
C21  ValueDisplayed: 0.1uF  [0603L]  (hidden comment: CGA3E3X7S2A104K080AB)
C22  VDC_V: 100V  ValueDisplayed: 1uF  [1206_180]  (hidden comment: CL31B105KCHNNNE)
D8  CDSU101A  [SOD-523F]
J7  POWER_IN  [On-Shore_ED120_3DS]
J8  MOTOR_OUT  [On-Shore_ED120_3DS]
L4  HCM1A1104V2-1R0-R  [FP-HCM1A1104V2-1R0-R_SMD2-MFG]  (value not drawn)
NT2  Net-Tie  [Net-Tie_50milWide_30milLong]  (value not drawn)  (net tie, no BOM)
Q1  FMMT620TA  [SOT-23L]  (value not drawn)
Q2  BUK9D23-40EX  [FP-BUK9D23-40EX_SOT1220-MFG]
R30  value 10k  [0603L]  (hidden comment: CRCW060310K0JNEA)
R31  value 10k  [0603L]  (hidden comment: CRCW060310K0JNEA)
R32  ValueDisplayed: 0  [1206L]  (hidden comment: RCA12060000ZSEA)
TP23  VBAT  [Keystone5005]
TP24  VM  [Keystone5005]
TP25  PGND  [Keystone5001]
TP26  AGND  [Harwin_D3082-05]
TP27  AGND  [Harwin_D3082-05]
TP28  PGND  [Harwin_D3082-05]
TP29  PGND  [Harwin_D3082-05]
TP30  AGND  [Keystone5001]
TP31  AGND  [Keystone5001]
TP32  AGND  [Keystone5001]
TP33  PGND  [Keystone5001]

### Blocks framed on the sheet
MAIN SUPPLY: C14-C22 D8 J7 L4 Q1 Q2 R30 R31 TP23-TP25
CONNECTORS & INTERFACE: J8 NT2 R32 TP26-TP33

### Nets
AGND: NT2.1 R32.1 TP26.1 TP26.2 TP27.1 TP27.2 TP30.1 TP31.1 TP32.1
PGND: C14.2(-) C15.2 C16.2 C17.2 C18.2 C19.2 C20.2 C21.2 C22.2 J7.2 NT2.2 R31.2 R32.2 TP25.1 TP28.1 TP28.2 TP29.1 TP29.2 TP33.1
VBAT: D8.1(K) J7.3 Q2.4(S) Q2.8(S) TP23.1
VM: C14.1(+) C19.1 C20.1 C21.1 C22.1 J7.1 L4.2 TP24.1
OUTA: J8.1
OUTB: J8.2
OUTC: J8.3
VCP: R30.1
NetC15_1: C15.1 C16.1 C17.1 C18.1 L4.1 Q2.1(D) Q2.2(D) Q2.5(D) Q2.6(D) Q2.7(D)
NetD8_2: D8.2(A) Q1.2(E)
NetQ1_1: Q1.1(B) R31.1
NetQ1_3: Q1.3(C) Q2.3(G) R30.2

### Notes on the sheet
- 40V ABS MAX
- 4.5-V to 35-V Operation
- Reverse Polarity Protection
- bypass RPP
- Connect to VM to
- Pi Filter
- Motor Output
- Grounding
- Drawn By:
- SVN Rev:
- Number:
- TID #:
- Orderable:
- Rev:
- Sheet Title:
- File:
- Project Title:
- Designed for:
- Assembly Variant:
- Mod. Date:
- Sheet:
- Size:
- of
- B
- http://www.ti.com
- Texas Instruments and/or its licensors do not warrant the accuracy or completeness of this specification or any information contained therein. Texas Instruments and/or its licensors do not warrant that this design will meet the specifications, will be suitable for your application or fit for any particular purpose, or will operate in an implementation. Texas Instruments and/or its licensors do not warrant that the design is production worthy. You should completely validate and test your design implementation to confirm the system functionality for your application.
- Engineer:
- Contact:
- © Texas Instruments

### Library data of the parts
C14 = CMP-0009912-2: CAP, AL, 330 uF, 63 V, +/- 20%, AEC-Q200 Grade 2, TH; Manufacturer: Chemi-Con; Polarized: Y; CompType: Capacitor; Value: 330uF; U/M: EA; Cap_F: 330µF; Value1: Unknown; VDC_V: 63V; IRMS_A: 1.29A; TaMin_C: -55°C; TaMax_C: 105°C; Cap_Case: 12.5x20mm; AEC Category: Q200; AEC Grade: 2; SizeAreaWB_mm2: 210.25; SizeArea_mm2: 156.25; SizeX_mm: 12.5; SizeZ_mm: 21.5; PartNumber: ELXZ630ELL331MK20S; PackageReference: D12.5xL20mm; RoHS: Y; Tolerance_%: 20%; Value2: 63V; MountType: TH; Technology: AL; Series: LXZ; Publisher: Texas Instruments; LatestRevisionDate: 2017-03-09; ComponentLink1Description: Datasheet link; ComponentLink1URL: http://www.chemi-con.co.jp/cgi-bin/CAT_DB/SEARCH/cat_db_al.cgi?e=e&j=p&pdfname=lxz; Supplier 1: Digi-Key; Supplier Part Number 1: 565-2043-ND; Supplier 2: Mouser; Supplier Part Number 2: 661-ELXZ630ELL331MK2; AEC Qualified: Y; SizeY_mm: 12.5
C15 C22 = CMP-0008801-2: CAP, CERM, 1 uF, 100 V, +/- 10%, X7R, 1206; Manufacturer: Samsung; TaMin_C: -55°C; Polarized: N; SizeAreaWB_mm2: 10.92; Value1: Unknown; U/M: EA; Value: 1uF; TaMax_C: 125°C; SizeZ_mm: 1.8; SizeX_mm: 3.2; SizeY_mm: 1.6; Cap_Case: 1206; SizeArea_mm2: 5.12; Cap_F: 1µF; AEC Category: Q200; Publisher: Texas Instruments; TempCo: X7R; Published: 2008-06-19; RoHS: Y; MountType: SMT; Supplier 1: Digi-Key; PackageReference: 1206; Tolerance_%: 10%; Value2: 100V; CompType: Capacitor; LatestRevisionDate: 2017-03-09; PartNumber: CL31B105KCHNNNE; AEC Qualified: N; ComponentLink1Description: Datasheet link; AEC Grade: N/A; Supplier Part Number 1: 1276-1838-1-ND; Technology: Ceramic; ComponentLink1URL: http://www.samsungsem.com/kr/front/downloadcms.do?path=/kr/support/product-search/mlcc/__icsFiles/afieldfile/2014/11/05&fileName=C_CL31B105KCHNNNE.pdf
C16 C21 = CMP-0007099-4: CAP, CERM, 0.1 uF, 100 V, +/- 10%, X7S, AEC-Q200 Grade 1, 0603; Manufacturer: TDK; Polarized: N; Value: 0.1uF; U/M: EA; Cap_F: 100nF; ESR_ohm: 0.04959; Value1: 0.04959 ohm; VDC_V: 100V; IRMS_A: 751.618mA; TaMin_C: -55°C; TaMax_C: 125°C; Cap_Case: 0603; AEC Category: Q200; AEC Qualified: Y; AEC Grade: 1; SizeAreaWB_mm2: 4.68; SizeX_mm: 1.6; SizeY_mm: 0.8; SizeArea_mm2: 1.28; CompType: Capacitor; PartNumber: CGA3E3X7S2A104K080AB; PackageReference: 0603; RoHS: Y; Tolerance_%: 10%; Value2: 100V; MountType: SMT; Technology: Ceramic; TempCo: X7S; Published: 2008-06-19; Publisher: Texas Instruments; LatestRevisionDate: 2017-03-09; ComponentLink1Description: Datasheet link; ComponentLink1URL: https://product.tdk.com/en/search/capacitor/ceramic/mlcc/info?part_no=CGA3E3X7S2A104K080AB; Supplier 1: Digi-Key; Supplier Part Number 1: 445-6938-1-ND; Supplier 2: Newark; Supplier Part Number 2: 04X3163; Supplier 3: Mouser; Supplier Part Number 3: 810-CGA3E3X7S2A104K; SizeZ_mm: 1
C17 C20 = CMP-0007082-4: CAP, CERM, 0.01 uF, 100 V, +/- 10%, X7R, AEC-Q200 Grade 1, 0603; Manufacturer: TDK; Polarized: N; Value: 0.01uF; U/M: EA; Cap_F: 10nF; ESR_ohm: 0.235428; Value1: 0.235428 ohm; VDC_V: 100V; IRMS_A: 396.995mA; TaMin_C: -55°C; TaMax_C: 125°C; Cap_Case: 0603; AEC Category: Q200; AEC Qualified: Y; AEC Grade: 1; SizeArea_mm2: 1.28; SizeAreaWB_mm2: 4.68; SizeX_mm: 1.6; SizeY_mm: 0.8; CompType: Capacitor; PartNumber: CGA3E2X7R2A103K080AA; PackageReference: 0603; RoHS: Y; Tolerance_%: 10%; Value2: 100V; MountType: SMT; Technology: Ceramic; TempCo: X7R; Published: 2008-06-19; Publisher: Texas Instruments; LatestRevisionDate: 2017-03-09; ComponentLink1Description: Datasheet link; ComponentLink1URL: https://product.tdk.com/en/search/capacitor/ceramic/mlcc/info?part_no=CGA3E2X7R2A103K080AA; Supplier 1: Digi-Key; Supplier Part Number 1: 445-5812-1-ND; Supplier 2: Mouser; Supplier Part Number 2: 810-CGA3E2X7R2A103K080AA; SizeZ_mm: 1
C18 C19 = CMP-0007081-4: CAP, CERM, 1000 pF, 100 V, +/- 10%, X7R, AEC-Q200 Grade 1, 0603; Manufacturer: TDK; Polarized: N; Value: 1000pF; U/M: EA; Cap_F: 1nF; ESR_ohm: 1.97137; Value1: 1.97137 ohm; VDC_V: 100V; IRMS_A: 305.705mA; TaMin_C: -55°C; TaMax_C: 125°C; Cap_Case: 0603; AEC Category: Q200; AEC Qualified: Y; AEC Grade: 1; SizeArea_mm2: 1.28; SizeAreaWB_mm2: 4.68; SizeX_mm: 1.6; SizeY_mm: 0.8; CompType: Capacitor; PartNumber: CGA3E2X7R2A102K080AA; PackageReference: 0603; RoHS: Y; Tolerance_%: 10%; Value2: 100V; MountType: SMT; Technology: Ceramic; TempCo: X7R; Published: 2008-06-19; Publisher: Texas Instruments; LatestRevisionDate: 2017-03-09; ComponentLink1Description: Datasheet link; ComponentLink1URL: https://product.tdk.com/en/search/capacitor/ceramic/mlcc/info?part_no=CGA3E2X7R2A102K080AA; Supplier 1: Digi-Key; Supplier Part Number 1: 445-5806-1-ND; Supplier 2: Mouser; Supplier Part Number 2: 810-CGA3E2X7R2A102K080AA; SizeZ_mm: 1
D8 = CMP-0076943-3: Diode, Switching, 90 V, 0.1 A, SOD-523F; Manufacturer: Comchip Technology; SizeAreaWB_mm2: 5.13; Vr_V: 90V; SizeArea_mm2: 1.53; TJmax_C: 125°C; AEC Category: Q101; Value: 90V; SizeZ_mm: 0.85; Green_REACh: Incomplete; Io_A: 100mA; Vf_V: 1V; SizeY_mm: 0.9; Green_Lifecycle: Not Set; Value1: 0.1A; SizeX_mm: 1.7; MFG_Status: TI_Obsolete; ComponentLink1Description: Datasheet link; RoHS: Y; AEC Qualified: ?; Green_EU RoHS: Incomplete; PackageReference: SOD-523F; PartNumber: CDSU101A; Value2: 1V; ComponentLink1URL: http://www.comchiptech.com/cms/UserFiles/CDSU101A-RevA371622.pdf; CompType: Diode; MountType: SMT; Type: Switching; Green_EU RoHS-2: Incomplete
J7 J8 = CMP-0074911-1: Terminal Block, 5.08 mm, 3x1, Brass, TH; Manufacturer: On-Shore Technology; PartNumber: ED120/3DS; Cert_VDE: Y; CNHeader: False; Current_A: 15A; Green_Lifecycle: Not Set; Shrouded: N; Gender: Female; Green_REACh: Incomplete; Voltage_V: 300V; Row_Count: 1; Pitch_mm: 5.08; CT: True; ComponentLink1URL: http://www.on-shore.com/sites/default/files/manuals/ed120ds.pdf; Publisher: Texas Instruments; Color: Blue; Cert_CULUS: Y; RoHS: Y; MountType: TH; Green_EU RoHS-2: Incomplete; Supplier 1: Digi-Key; Green_EU RoHS: Incomplete; PackageReference: 3x1 5.08 mm Terminal Block; PinCount: 3; CompType: Terminal Block; LatestRevisionDate: 2017-07-12; Orientation: Vertical; ComponentLink1Description: Datasheet URL; Supplier Part Number 1: ED1610-ND; ContactFinish: Brass
L4 = CMP-0094173-1: 1 µH Shielded - Inductor 19 A 3.1mOhm Max Nonstandard; Manufacturer: Eaton; Isat: 25A; Irms: 19A; DCR_ohm: 3.1m; Material: Alloy powder; Value: 1uH; SizeZ_mm: 4mm; Ind_H: 1µH; AEC Qualified: Yes; AEC Grade: Grade 0; Shrouded: true; Test Frequency: 100kHz; Self Resonant Frequency: 38MHz; Tolerance_%: 20%; ComponentLink1URL: https://www.eaton.com/content/dam/eaton/products/electronic-components/resources/data-sheet/eaton-hcm1a1104v2-automotive-power-inductors-data-sheet.pdf; RoHS: TRUE; PackageReference: SMD2; PartNumber: HCM1A1104V2-1R0-R; ComponentLink1Description: Datasheet; Supplier 1: Digikey; Supplier 2: Mouser; Supplier Part Number 1: 283-HCM1A1104V2-1R0-RCT-ND; Supplier Part Number 2: 504-HCM1A1104V21R0-R; Part Number: HCM1A1104V2-1R0-R; Operating Temperature Range: -55°C to +155°C; datasheet: https://www.eaton.com/content/dam/eaton/products/electronic-components/resources/data-sheet/eaton-hcm1a1104v2-automotive-power-inductors-data-sheet.pdf; Lead Free: Yes; Digikey Part Number: 283-HCM1A1104V2-1R0-RCT-ND; helpURL: https://upverter.com/upn/revision/8b90632ea16fe584/; Digikey Description: FIXED IND 1UH 19A 3.1 MOHM SMD; Mouser Part Number: 504-HCM1A1104V21R0-R; Datasheet Path: datasheets/Ind-HCM1A1104V2-1R0-R.pdf
NT2 = CMP-0078142-4: Single point connection between nets.; CompType: Net-Tie; PackageReference: N/A; Library Reference: Net-Tie; Manufacturer: N/A; PartNumber: N/A; MountType: SMT
Q1 = CMP-0000467-2: Transistor, NPN, 80 V, 1.5 A, AEC-Q101, SOT-23; Manufacturer: Diodes Inc.; TaMax_C: 150°C; Value2: 900; Value1: 1.5 A; Vcesat1_V: 160mV; SizeX_mm: 2.5; SizeY_mm: 3; TaMin_C: -55°C; IcRated_A: 1.5A; CompType: BJT; SizeZ_mm: 1.1; AEC Qualified: Y; Value: 80 V; SizeArea_mm2: 7.5; NPN: 1; Vceo_V: 80V; PNP: 0; AEC Category: Q101; SizeAreaWB_mm2: 14; U/M: EA; Supplier 2: Newark; Supplier 3: Mouser; Supplier 1: Digi-Key; Supplier Part Number 1: FMMT620CT-ND; Supplier Part Number 2: 65T9129; Supplier Part Number 3: 522-FMMT620TA; PartNumber: FMMT620TA; LatestRevisionDate: 2017-03-09; ComponentLink1URL: http://www.diodes.com/datasheets/FMMT620.pdf; Publisher: Texas Instruments; ComponentLink1Description: Datasheet link; HfeMax: 900; Published: 2008-07-31; RoHS: Y; PackageReference: SOT-23; MountType: SMT
Q2 = CMP-0088880-1: N-Channel 40V 8A (Ta) 15W (Tc) Surface Mount DFN2020MD-6; Manufacturer: Nexperia; Reverse Recovery Charge: 5.3nC; Vgs_V: 15V; Rthja Max: 57K/W; Number Of N Channels: 1; Pulse Drain Current: 76A; Threshold Vgs Max: 2.1V; Power_W: 2.3W; Reverse Recovery Time: 12.9ns; TaMin_C: -55°C; Rdson45_ohm: 0.018; SizeZ_mm: 0.65mm; ChMode: False; Transconductance: 39S; AEC Qualified: Yes; Typ Forward Diode Voltage: 0.8V; Turn Off Delay Time: 12ns; TaMax_C: +175°C; Input Capacitace At Vds: 637pF @ 20V; QgTyp_nC: 11.5nC @ 10V; Threshold Vgs Min: 1.4V; AEC Grade: Grade 0; VdsMax_V: 1.2V; Turn On Delay Time: 2ns; Device Class L1: Discrete Semiconductors; PartNumber: BUK9D23-40EX; PackageReference: SOT1220; Digikey Description: MOSFET N-CH 40V 8A 6DFN2020MD; Mouser Part Number: 771-BUK9D23-40EX; RoHS: TRUE; Device Class L2: Transistors; ComponentLink1URL: https://assets.nexperia.com/documents/data-sheet/BUK9D23-40E.pdf; Lead Free: Yes; IdsMax_A: 8A; ComponentLink1Description: Datasheet; Operating Temperature Range: -55°C to +175°C; Digikey Part Number: 1727-7413-1-ND; datasheet: https://assets.nexperia.com/documents/data-sheet/BUK9D23-40E.pdf; Part Number: BUK9D23-40EX; Number Of Channels: 1; Datasheet Path: datasheets/Trans-BUK9D23-40EX.pdf; helpURL: https://upverter.com/upn/revision/bf3b926f6919405d/; Device Class L3: MOSFETs; Drain To Source Breakdown Voltage: 40V; TJmax_C: +175°C
R30 R31 = CMP-0025701-4: RES, 10 k, 5%, 0.1 W, AEC-Q200 Grade 0, 0603; Manufacturer: Vishay-Dale; Value_Code: 10k0; Power_W: 100mW; Value2: 0.1W; VDC_V: 75V; TempCo: 200 ppm/C; EIA_Code: E24; AEC Category: Q200; AEC Qualified: Y; AEC Grade: 0; SizeArea_mm2: 1.28; SizeX_mm: 1.6; SizeY_mm: 0.8; SizeZ_mm: 1; CompType: Resistor; PartNumber: CRCW060310K0JNEA; PackageReference: 0603; RoHS: E; Res_ohm: 10k; Tolerance_%: 5%; Value1: 5%; MountType: SMT; Technology: Thick Film; ComponentLink1Description: Datasheet link; ComponentLink1URL: http://www.vishay.com/docs/20035/dcrcwe3.pdf; Supplier 1: Digi-Key; Supplier Part Number 1: 541-10KGCT-ND; Supplier 2: Newark; Supplier Part Number 2: 52K8066; Supplier 3: Mouser; Supplier Part Number 3: 71-CRCW0603J-10K-E3; ValueDisplayed: 10k
R32 = CMP-0018760-2: RES, 0, 5%, 0.25 W, AEC-Q200 Grade 0, 1206; Manufacturer: Vishay-Dale; Power_W: 250mW; TempCo: ppm/C; Value_Code: 0000; U/M: EA; Value: 0; EIA_Code: E24; SizeX_mm: 3.2; SizeY_mm: 1.6; SizeZ_mm: 1.35; Value2: 0.25W; SizeArea_mm2: 5.12; AEC Qualified: Y; AEC Category: Q200; ComponentLink1URL: http://www.vishay.com/docs/20037/rcae3.pdf; Supplier Part Number 2: 98Y2329; Publisher: Texas Instruments; Supplier 2: Newark; Supplier Part Number 3: 2616593; Supplier 3: Farnell; Published: 2008-06-26; RoHS: Y; Value1: 5%; MountType: SMT; Supplier 1: Digi-Key; PackageReference: 1206; Tolerance_%: 5%; Res_ohm: 0; CompType: Resistor; LatestRevisionDate: 2017-03-09; PartNumber: RCA12060000ZSEA; ComponentLink1Description: Datasheet link; AEC Grade: 0; Supplier Part Number 1: 541-2239-1-ND; Technology: Thick Film
TP23 TP24 = CMP-0055142-1: Test Point, Compact, Red, TH; Manufacturer: Keystone; CNHeader: FALSE; ContactFinish: Silver; CT: TRUE; Green_Lifecycle: Active; Green_REACh: Passed; PartNumber: 5005; PackageReference: Red Compact Testpoint; CompType: Test Point; RoHS: Y; MountType: TH; ComponentLink1Description: Datasheet URL; ComponentLink1URL: http://www.keyelco.com/userAssets/file/M60-2p60.pdf; Publisher: Texas Instruments; LatestRevisionDate: 26/05/2017; Supplier 1: Digi-Key; Supplier Part Number 1: 36-5005-ND; Supplier 2: Mouser; Supplier Part Number 2: 534-5005; Color: Red; Green_EU RoHS-2: Passed; Green_EU RoHS: Passed
TP25 TP30-TP33 = CMP-0055138-1: Test Point, Miniature, Black, TH; Manufacturer: Keystone; CNHeader: FALSE; Green_Lifecycle: Active; Green_REACh: Passed; ContactFinish: Silver; CT: TRUE; ComponentLink1URL: http://www.keyelco.com/userAssets/file/M60-2p60.pdf; Supplier Part Number 2: 534-5001; Publisher: Texas Instruments; Supplier 2: Mouser; Color: Black; RoHS: Y; MountType: TH; Green_EU RoHS-2: Incomplete; Supplier 1: Digi-Key; Green_EU RoHS: Passed; PackageReference: Black Miniature Testpoint; CompType: Test Point; LatestRevisionDate: 26/05/2017; PartNumber: 5001; ComponentLink1Description: Datasheet URL; Supplier Part Number 1: 36-5001-ND
TP26-TP29 = CMP-0075110-1: 1mm Uninsulated Shorting Plug, 10.16mm spacing, TH; Manufacturer: Harwin; PartNumber: D3082-05; CNHeader: False; Green_Lifecycle: Active; Green_REACh: Passed; CompType: Jumper Wire; ComponentLink1URL: http://cdn.harwin.com/pdfs/D3080-D3083.pdf; Supplier Part Number 2: 01E9240; Publisher: Texas Instruments; Supplier 2: Newark; Supplier Part Number 3: 855-D3082-05; Supplier 3: Mouser; RoHS: Y; MountType: TH; Green_EU RoHS-2: Passed; Supplier 1: Digi-Key; Green_EU RoHS: Passed with Exemption; PackageReference: Shorting Plug, 10.16mm spacing, TH; LatestRevisionDate: 2017-07-12; ComponentLink1Description: Datasheet URL; Supplier Part Number 1: 952-1873-ND; CT: False

## Nets that join several sheets
AGND: MD070B_CONTROL (R4.3 R6.1 R7.1 R8.1), MD070B_DRIVER (21 pins), MD070B_INTERFACE (25 pins), MD070B_POWER_AND_CONNECTORS (9 pins)
AVDD: MD070B_CONTROL (R1.2 R2.2 R3.2 R4.1), MD070B_DRIVER (6 pins)
PGND: MD070B_DRIVER (6 pins), MD070B_POWER_AND_CONNECTORS (19 pins)
VBK: MD070B_DRIVER (8 pins), MD070B_INTERFACE (J6.3)
VM: MD070B_DRIVER (7 pins), MD070B_POWER_AND_CONNECTORS (8 pins)
ALARM: MD070B_DRIVER (D3.1 R22.1 U1.39), MD070B_INTERFACE (J6.9)
BRAKE: MD070B_DRIVER (U1.35), MD070B_INTERFACE (J6.27)
BRAKE_SW: MD070B_CONTROL (S1.2 TP2.1), MD070B_INTERFACE (J6.28)
DIR: MD070B_DRIVER (U1.34), MD070B_INTERFACE (J6.29)
DIR_SW: MD070B_CONTROL (S2.2 TP3.1), MD070B_INTERFACE (J6.30)
DRVOFF: MD070B_DRIVER (U1.21), MD070B_INTERFACE (J6.31)
DRVOFF_SW: MD070B_CONTROL (S3.2 TP4.1), MD070B_INTERFACE (J6.32)
FG: MD070B_DRIVER (R10.1 TP17.1 U1.29), MD070B_INTERFACE (J6.5)
MCX_SCL: MD070B_DRIVER (R11.2 R13.1), MD070B_INTERFACE (J6.23)
MCX_SDA: MD070B_DRIVER (R12.2 R14.1), MD070B_INTERFACE (J6.21)
MSP_PWM: MD070B_CONTROL (J1.2), MD070B_INTERFACE (U4.42)
nFAULT: MD070B_DRIVER (R24.1 U1.40), MD070B_INTERFACE (J6.7)
OUTA: MD070B_DRIVER (TP9.1 U1.13 U1.14), MD070B_POWER_AND_CONNECTORS (J8.1)
OUTB: MD070B_DRIVER (TP10.1 U1.16 U1.17), MD070B_POWER_AND_CONNECTORS (J8.2)
OUTC: MD070B_DRIVER (TP11.1 U1.19 U1.20), MD070B_POWER_AND_CONNECTORS (J8.3)
PIN_36: MD070B_DRIVER (R19.1 TP16.1 U1.36), MD070B_INTERFACE (J6.11)
PIN_37: MD070B_DRIVER (R20.1 TP14.1 U1.37), MD070B_INTERFACE (J6.13)
PIN_38: MD070B_DRIVER (R21.1 TP15.1 U1.38), MD070B_INTERFACE (J6.15)
POT: MD070B_CONTROL (J1.4 R5.1), MD070B_INTERFACE (U4.43)
SPEED: MD070B_DRIVER (U1.28), MD070B_INTERFACE (J6.25)
SPEED_IN: MD070B_CONTROL (J1.1 J1.3 J1.5), MD070B_INTERFACE (J6.26)
VCP: MD070B_DRIVER (C1.1 U1.8), MD070B_POWER_AND_CONNECTORS (R30.1)

## Assembly variants
001: not fitted L1 L2 R15 R16 R17 R18 R19 R20 R21 R22
002: not fitted L1 L2 R15 R16 R17 R18 R19 R20 R21 R22; alternate parts U1 -> CMP-0097011-1